# Altium schematic sheet Sheet1.SchDoc
size A; SheetNumber: 1; SheetTotal: 1
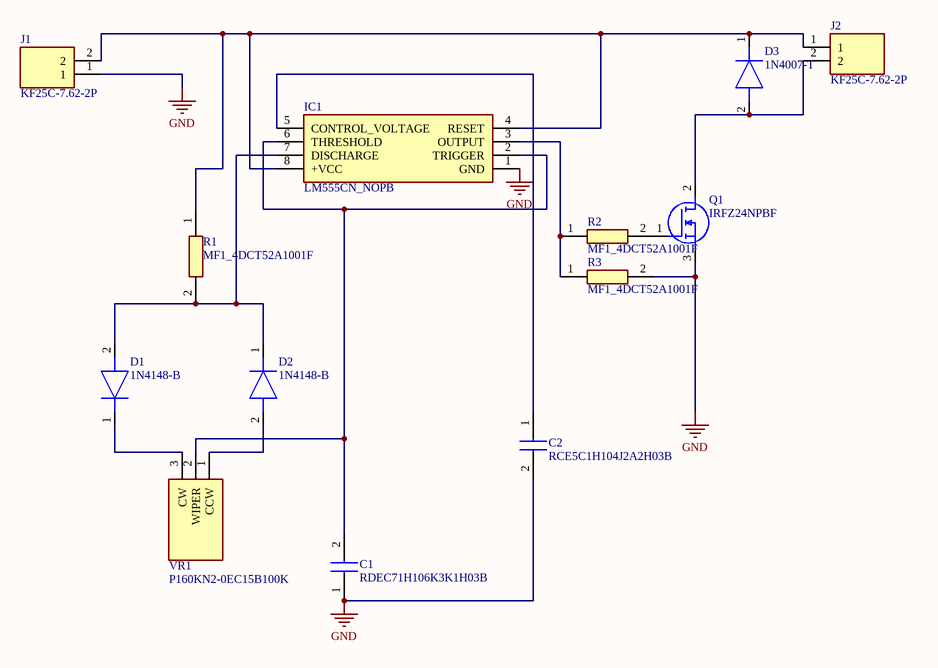
[diagram p0: Sheet1.SchDoc]

## Parts
C1  RDEC71H106K3K1H03B  [RDEC71H106K3K1H03B]
C2  RCE5C1H104J2A2H03B  [RCE5C1H104J2A2H03B]
D1  1N4148-B  [DIOAD1220W56L420D200]
D2  1N4148-B  [DIOAD1220W56L420D200]
D3  1N4007-T  [DIOAD1408W86L464D236]
IC1  LM555CN_NOPB  [DIP794W53P254L959H508Q8N]
J1  KF25C-7.62-2P  [KF25C7622P]
J2  KF25C-7.62-2P  [KF25C7622P]
Q1  IRFZ24NPBF  [TO254P469X1042X1967-3P]
R1  MF1_4DCT52A1001F  [RESAD1630W60L710D230]
R2  MF1_4DCT52A1001F  [RESAD1630W60L710D230]
R3  MF1_4DCT52A1001F  [RESAD1630W60L710D230]
VR1  P160KN2-0EC15B100K  [P160KN20EC15B100K]

## Nets
GND: C1.1 C2.2 IC1.1(GND) J1.1 Q1.3(S) R3.2
NetC1_2: C1.2 IC1.2(TRIGGER) IC1.6(THRESHOLD) VR1.2(WIPER)
NetC2_1: C2.1 IC1.5(CONTROL_VOLTAGE)
NetD1_1: D1.1(K) VR1.3(CW)
NetD1_2: D1.2(A) D2.1(K) IC1.7(DISCHARGE) R1.2
NetD2_2: D2.2(A) VR1.1(CCW)
NetD3_1: D3.1(K) IC1.4(RESET) IC1.8(+VCC) J1.2 J2.1 R1.1
NetD3_2: D3.2(A) J2.2 Q1.2(D)
NetIC1_3: IC1.3(OUTPUT) R2.1 R3.1
NetQ1_1: Q1.1(G) R2.2

## Library data of the parts
C1 = RDEC71H106K3K1H03B: Capacitor; Manufacturer_Name: Murata Electronics; Datasheet Link: https://psearch.en.murata.com/capacitor/product/RDEC71H106K3K1H03B.html; Height: 7.5mm; Manufacturer_Part_Number: RDEC71H106K3K1H03B; Mouser Part Number: 81-RDEC71H106K3K1H3B; Mouser Price/Stock: https://www.mouser.co.uk/ProductDetail/Murata-Electronics/RDEC71H106K3K1H03B?qs=hNud%2FORuBR3znCHotF4tAw%3D%3D; Arrow Part Number: RDEC71H106K3K1H03B; Arrow Price/Stock: https://www.arrow.com/en/products/rdec71h106k3k1h03b/murata-manufacturing?region=nac
C2 = RCE5C1H104J2A2H03B: Capacitor; Manufacturer_Name: Murata Electronics; Datasheet Link: https://psearch.en.murata.com/capacitor/product/RCE5C1H104J2A2H03B.html; Height: 5.5mm; Manufacturer_Part_Number: RCE5C1H104J2A2H03B; Mouser Part Number: 81-RCE5C1H104J2A2H3B; Mouser Price/Stock: https://www.mouser.co.uk/ProductDetail/Murata-Electronics/RCE5C1H104J2A2H03B?qs=qSfuJ%252Bfl%2Fd7lCZVqlAdNaA%3D%3D
D1 D2 = 1N4148-B: Diode; Manufacturer_Name: Rectron; Datasheet Link: https://www.mouser.com/datasheet/2/345/1n4148-32420.pdf; Manufacturer_Part_Number: 1N4148-B; Mouser Part Number: 583-1N4148-B; Mouser Price/Stock: https://www.mouser.co.uk/ProductDetail/Rectron/1N4148-B?qs=sWbhZyXmMVdOMNi48au4Gw%3D%3D
D3 = 1N4007-T: Diode; Manufacturer_Name: Diodes Incorporated; Datasheet Link: https://www.diodes.com/assets/Datasheets/ds28002.pdf; Manufacturer_Part_Number: 1N4007-T; Mouser Part Number: 621-1N4007; Mouser Price/Stock: https://www.mouser.co.uk/ProductDetail/Diodes-Incorporated/1N4007-T?qs=e%2FRqmsgwm9iVtgJYUW23AA%3D%3D; Arrow Part Number: 1N4007-T; Arrow Price/Stock: https://www.arrow.com/en/products/1n4007-t/diodes-incorporated?region=europe
IC1 = LM555CN_NOPB: Integrated Circuit; Manufacturer_Name: Texas Instruments; Manufacturer_Part_Number: LM555CN/NOPB; Datasheet Link: https://datasheet.datasheetarchive.com/originals/distributors/Datasheets-SFU2/DSASFU100035550.pdf; Height: 5.08mm; Mouser Part Number: 926-LM555CN/NOPB; Mouser Price/Stock: https://www.mouser.co.uk/ProductDetail/Texas-Instruments/LM555CN-NOPB?qs=QbsRYf82W3GjZpQL%2FakZOg%3D%3D; Arrow Part Number: LM555CN/NOPB; Arrow Price/Stock: https://www.arrow.com/en/products/lm555cnnopb/texas-instruments?region=nac
J1 J2 = KF25C-7.62-2P: Connector; Manufacturer_Name: KEFA; Datasheet Link: https://datasheet.lcsc.com/lcsc/2007211836_Cixi-Kefa-Elec-KF25C-7-62-2P_C707361.pdf; Height: 14.9mm; Manufacturer_Part_Number: KF25C-7.62-2P
Q1 = IRFZ24NPBF: MOSFET (N-Channel); Manufacturer_Name: Infineon; Datasheet Link: https://www.mouser.com/datasheet/2/196/irfz24npbf-1227512.pdf; Height: 4.69mm; Manufacturer_Part_Number: IRFZ24NPBF; Mouser Part Number: 942-IRFZ24NPBF; Mouser Price/Stock: https://www.mouser.co.uk/ProductDetail/Infineon-Technologies/IRFZ24NPBF?qs=9%252BKlkBgLFf0TQgSTtY4J0g%3D%3D; Arrow Part Number: IRFZ24NPBF; Arrow Price/Stock: https://www.arrow.com/en/products/irfz24npbf/infineon-technologies-ag?region=europe
R1-R3 = MF1_4DCT52A1001F: Resistor; Manufacturer_Name: KOA Speer; Manufacturer_Part_Number: MF1/4DCT52A1001F; Datasheet Link: http://www.koaspeer.com/catimages/Products/MF-MFS-RK/MF-MFS-RK.pdf; Mouser Part Number: 660-MF1/4DCT52A1001F; Mouser Price/Stock: https://www.mouser.co.uk/ProductDetail/KOA-Speer/MF1-4DCT52A1001F?qs=GXuM9q1TrDlY%2FqXVQL%252Bxmw%3D%3D; Arrow Part Number: MF1/4DCT52A1001F; Arrow Price/Stock: https://www.arrow.com/en/products/mf14dct52a1001f/koa-speer-electronics
VR1 = P160KN2-0EC15B100K: Variable Resistor; Manufacturer_Name: TT Electronics; Datasheet Link: https://www.ttelectronics.com/TTElectronics/media/ProductFiles/Datasheet/P160.pdf; Height: 26.5mm; Manufacturer_Part_Number: P160KN2-0EC15B100K; Mouser Part Number: 858-P160KN20C15B100K; Mouser Price/Stock: https://www.mouser.co.uk/ProductDetail/BI-Technologies-TT-Electronics/P160KN2-0EC15B100K?qs=%252BUYXD5bnyXqjlf76hl%2F8FQ%3D%3D